# EAGLE design reg_board (EAGLE 9.6.2)
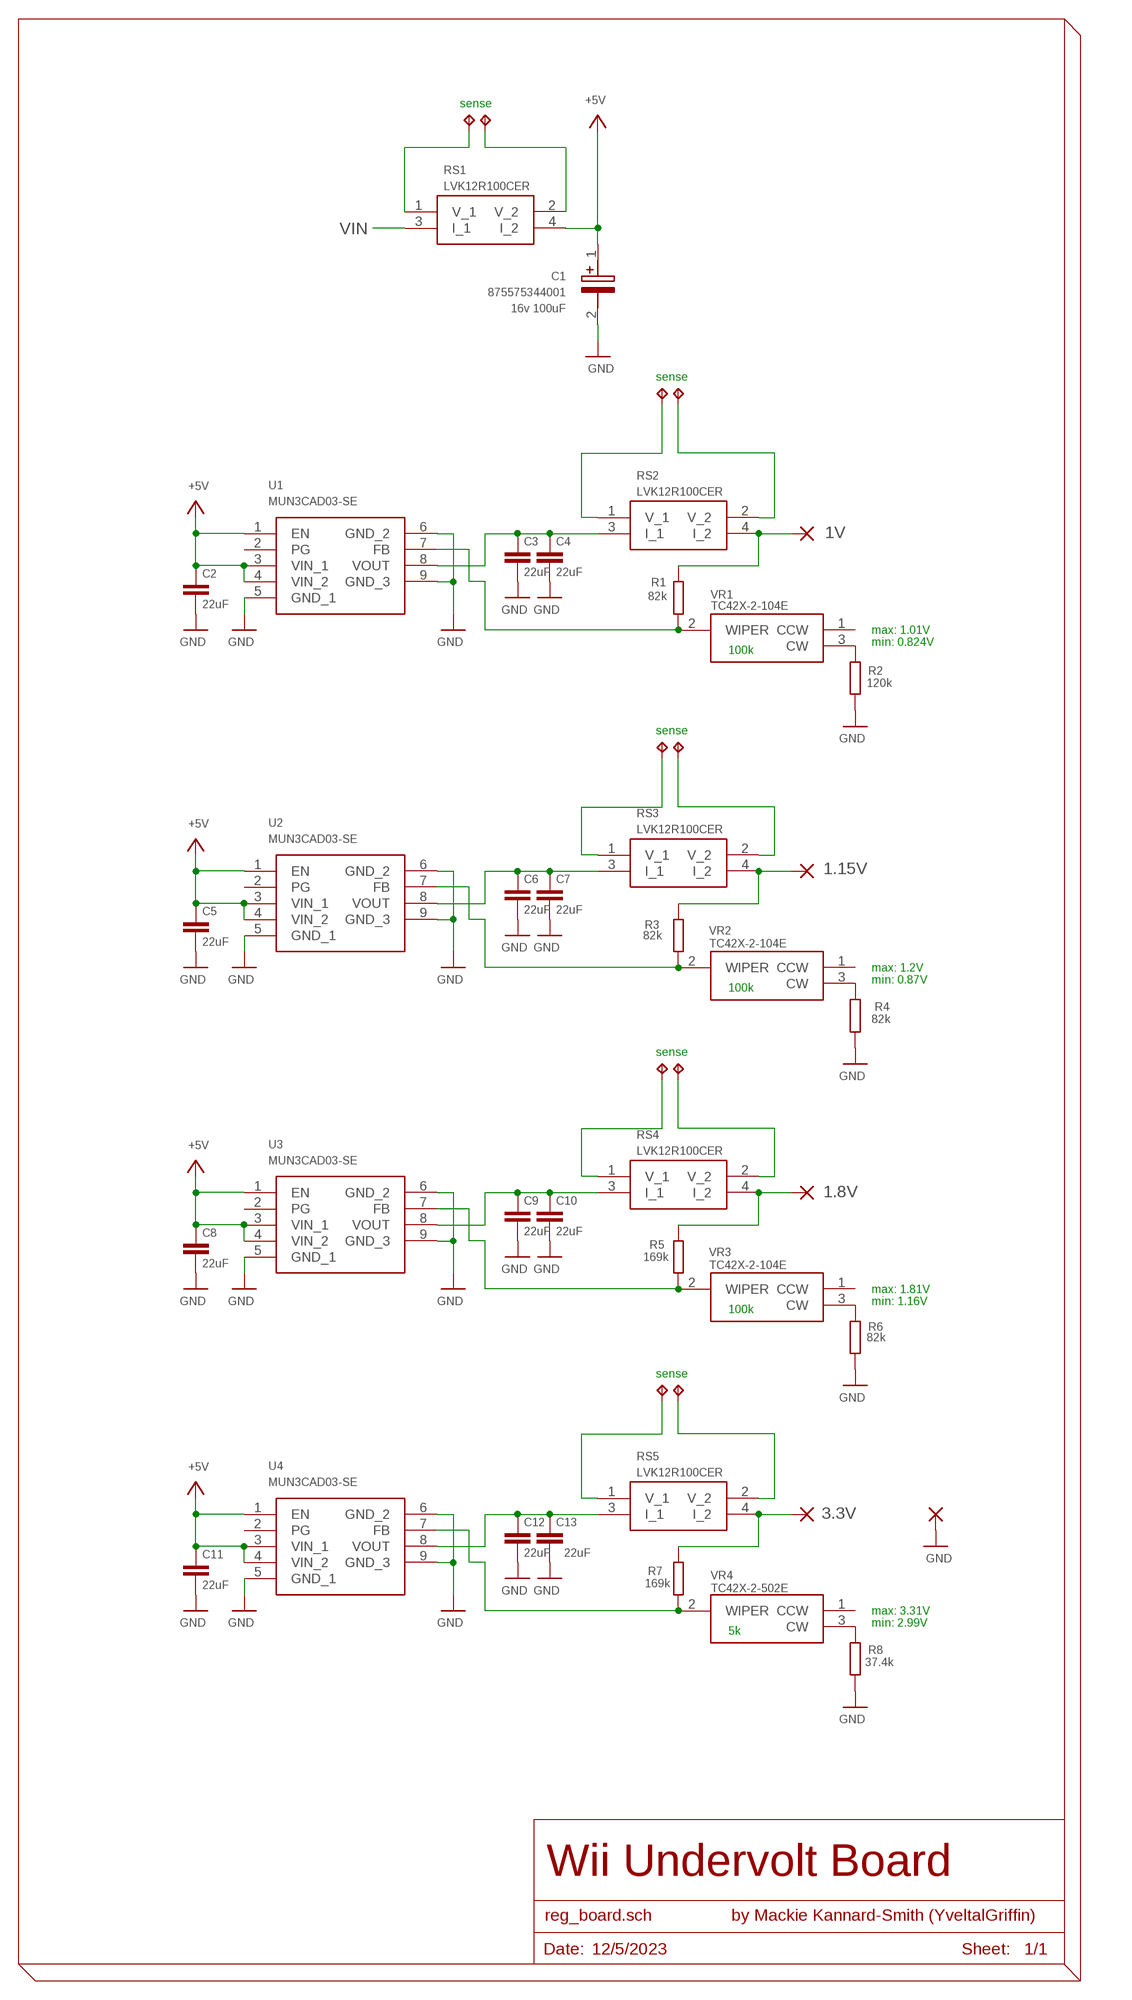
[diagram p0: schematic, sheet 1]

## Parts
C1  875575344001  [CAPAE660X610N]
C2  22uF  C-USC0603  [C0603]
C3  22uF  C-USC0603  [C0603]
C4  22uF  C-USC0603  [C0603]
C5  22uF  C-USC0603  [C0603]
C6  22uF  C-USC0603  [C0603]
C7  22uF  C-USC0603  [C0603]
C8  22uF  C-USC0603  [C0603]
C9  22uF  C-USC0603  [C0603]
C10  22uF  C-USC0603  [C0603]
C11  22uF  C-USC0603  [C0603]
C12  22uF  C-USC0603  [C0603]
C13  22uF  C-USC0603  [C0603]
PAD1  SMD5  [SMD2,54-5,08]
PAD2  SMD5  [SMD2,54-5,08]
PAD3  SMD5  [SMD2,54-5,08]
PAD4  SMD5  [SMD2,54-5,08]
PAD5  SMD5  [SMD2,54-5,08]
R1  82k  R-US_R0402  [R0402]
R2  120k  R-US_R0402  [R0402]
R3  82k  R-US_R0402  [R0402]
R4  82k  R-US_R0402  [R0402]
R5  169k  R-US_R0402  [R0402]
R6  82k  R-US_R0402  [R0402]
R7  169k  R-US_R0402  [R0402]
R8  37.4k  R-US_R0402  [R0402]
RS1  LVK12R100CER  [LVK12R100CER]
RS2  LVK12R100CER  [LVK12R100CER]
RS3  LVK12R100CER  [LVK12R100CER]
RS4  LVK12R100CER  [LVK12R100CER]
RS5  LVK12R100CER  [LVK12R100CER]
TP1  TPTP08R  [TP08R]
TP2  TPTP08R  [TP08R]
TP3  TPTP08R  [TP08R]
TP4  TPTP08R  [TP08R]
TP5  TPTP08R  [TP08R]
TP6  TPTP08R  [TP08R]
TP7  TPTP08R  [TP08R]
TP8  TPTP08R  [TP08R]
TP9  TPTP08R  [TP08R]
TP10  TPTP08R  [TP08R]
U1  MUN3CAD03-SE  [MUN3CAD03SE]
U2  MUN3CAD03-SE  [MUN3CAD03SE]
U3  MUN3CAD03-SE  [MUN3CAD03SE]
U4  MUN3CAD03-SE  [MUN3CAD03SE]
VR1  TC42X-2-104E  [TC42X2103E]
VR2  TC42X-2-104E  [TC42X2103E]
VR3  TC42X-2-104E  [TC42X2103E]
VR4  TC42X-2-502E  TC42X-2-104E  [TC42X2103E]

## Nets
1.8V: PAD4.1(P) R5.2 RS4.4(I_2)
1.15V: PAD3.1(P) R3.2 RS3.4(I_2)
1V: PAD1.1(P) R1.2 RS2.4(I_2)
3.3V: PAD5.1(P) R7.2 RS5.4(I_2)
+5V: C1.1(+) C2.1 C5.1 C8.1 C11.1 RS1.4(I_2) U1.1(EN) U1.3(VIN_1) U1.4(VIN_2) U2.1(EN) U2.3(VIN_1) U2.4(VIN_2) U3.1(EN) U3.3(VIN_1) U3.4(VIN_2) U4.1(EN) U4.3(VIN_1) U4.4(VIN_2)
GND: C1.2(-) C2.2 C3.2 C4.2 C5.2 C6.2 C7.2 C8.2 C9.2 C10.2 C11.2 C12.2 C13.2 PAD2.1(P) R2.1 R4.1 R6.1 R8.1 U1.5(GND_1) U1.6(GND_2) U1.9(GND_3) U2.5(GND_1) U2.6(GND_2) U2.9(GND_3) U3.5(GND_1) U3.6(GND_2) U3.9(GND_3) U4.5(GND_1) U4.6(GND_2) U4.9(GND_3)
N$1: R2.2 VR1.3(CW)
N$2: R4.2 VR2.3(CW)
N$3: R1.1 U1.7(FB) VR1.2(WIPER)
N$4: RS2.1(V_1) TP1.TP
N$5: RS2.2(V_2) TP2.TP
N$6: R6.2 VR3.3(CW)
N$7: RS1.2(V_2) TP3.TP
N$8: RS1.1(V_1) TP4.TP
N$9: R3.1 U2.7(FB) VR2.2(WIPER)
N$10: RS3.1(V_1) TP5.TP
N$11: RS3.2(V_2) TP6.TP
N$12: R5.1 U3.7(FB) VR3.2(WIPER)
N$13: RS4.1(V_1) TP7.TP
N$14: RS4.2(V_2) TP8.TP
N$15: R7.1 U4.7(FB) VR4.2(WIPER)
N$16: RS5.1(V_1) TP9.TP
N$17: RS5.2(V_2) TP10.TP
N$18: R8.2 VR4.3(CW)
VIN: RS1.3(I_1)
VOUT1: C3.1 C4.1 RS2.3(I_1) U1.8(VOUT)
VOUT2: C6.1 C7.1 RS3.3(I_1) U2.8(VOUT)
VOUT3: C9.1 C10.1 RS4.3(I_1) U3.8(VOUT)
VOUT4: C12.1 C13.1 RS5.3(I_1) U4.8(VOUT)
Unconnected: U1.2(PG) U2.2(PG) U3.2(PG) U4.2(PG) VR1.1(CCW) VR2.1(CCW) VR3.1(CCW) VR4.1(CCW)

## Notes on the sheet
- sense
- 16v 100uF
- sense
- max: 1.01V
  min: 0.824V
- 100k
- sense
- max: 1.2V
  min: 0.87V
- 100k
- sense
- max: 1.81V
  min: 1.16V
- 100k
- sense
- max: 3.31V
  min: 2.99V
- 5k
- Wii Undervolt Board
- reg_board.sch | by Mackie Kannard-Smith (YveltalGriffin)
- Date: | 12/5/2023 | Sheet:   1/1

## Library data of the parts
C1 = SamacSys_Parts:875575344001: Operating Temperature -55 up to +105 C Source: Datasheet <https://www.mouser.lu/datasheet/2/445/1/875575344001-3133041.pdf>; DESCRIPTION: Operating Temperature -55 up to +105 C; HEIGHT: 6.1mm; MANUFACTURER_NAME: Wurth Elektronik; MANUFACTURER_PART_NUMBER: 875575344001
C2-C13 = resistor:C-US: CAPACITOR, American symbol
PAD1-PAD5 = wirepad:SMD5: SMD PAD
R1-R8 = resistor:R-US_: RESISTOR, American symbol
RS1-RS5 = SamacSys_Parts:LVK12R100CER: Current Sense Resistors - SMD .1 OHM.25% 1/2W Source: Datasheet <https://www.ohmite.com/assets/docs/res_lvk.pdf>; DESCRIPTION: Current Sense Resistors - SMD .1 OHM.25% 1/2W; HEIGHT: 0.65mm; MANUFACTURER_NAME: Ohmite; MANUFACTURER_PART_NUMBER: LVK12R100CER; MOUSER_PART_NUMBER: 588-LVK12R100CER; MOUSER_PRICE-STOCK: https://www.mouser.co.uk/ProductDetail/Ohmite/LVK12R100CER?qs=Cb2nCFKsA8oBVfMdwpyWoQ%3D%3D
TP1-TP10 = testpad:TP: Test pad
U1-U4 = SamacSys_Parts:MUN3CAD03-SE: Non-Isolated DC/DC Converters 3A 5Vin inductor-integrated DC-DC converters Source: Datasheet; DESCRIPTION: Non-Isolated DC/DC Converters 3A 5Vin inductor-integrated DC-DC converters; HEIGHT: 1.3mm; MANUFACTURER_NAME: Delta Electronics; MANUFACTURER_PART_NUMBER: MUN3CAD03-SE; MOUSER_PART_NUMBER: 108-MUN3CAD03-SE; MOUSER_PRICE-STOCK: https://www.mouser.co.uk/ProductDetail/Delta-Electronics/MUN3CAD03-SE?qs=t7xnP681wgWoX6LfHO%2FvWw%3D%3D
VR1-VR4 = SamacSys_Parts:TC42X-2-104E: Trimmer Resistors - SMD 100K 2mm SMD Single Turn Source: Datasheet <https://www.bourns.com/docs/Product-Datasheets/TC42.pdf>; DESCRIPTION: Trimmer Resistors - SMD 100K 2mm SMD Single Turn; HEIGHT: 0.9mm; MANUFACTURER_NAME: Bourns; MANUFACTURER_PART_NUMBER: TC42X-2-104E; MOUSER_PART_NUMBER: 652-TC42X-2-104E; MOUSER_PRICE-STOCK: https://www.mouser.co.uk/ProductDetail/Bourns/TC42X-2-104E?qs=QYa8ZXxbnEbE7GBci46ntg%3D%3D

## Board
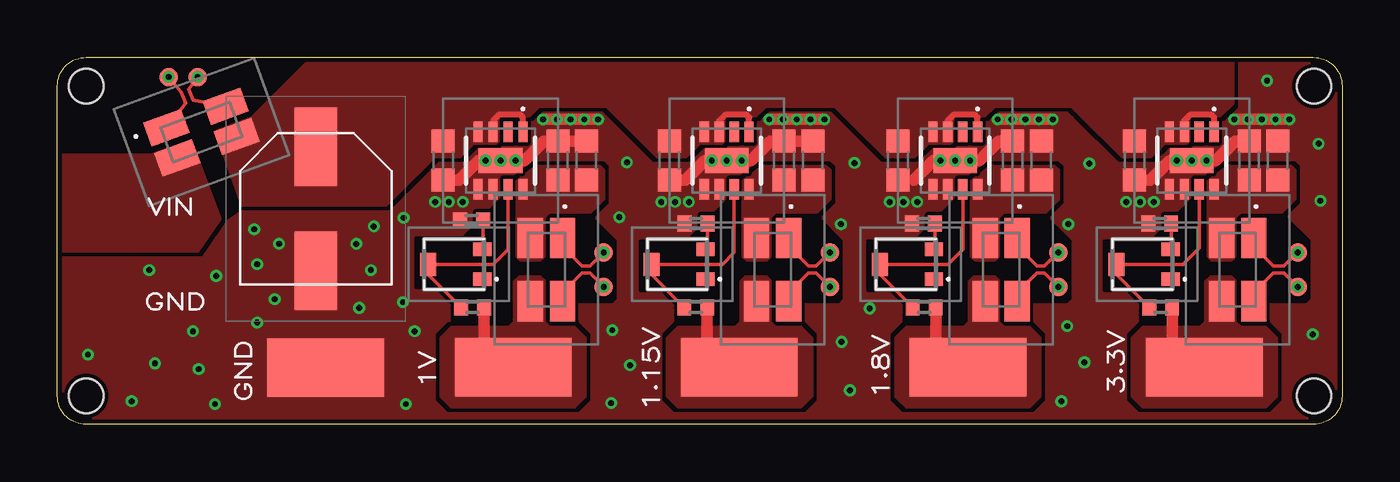
[diagram p1: board, top side]
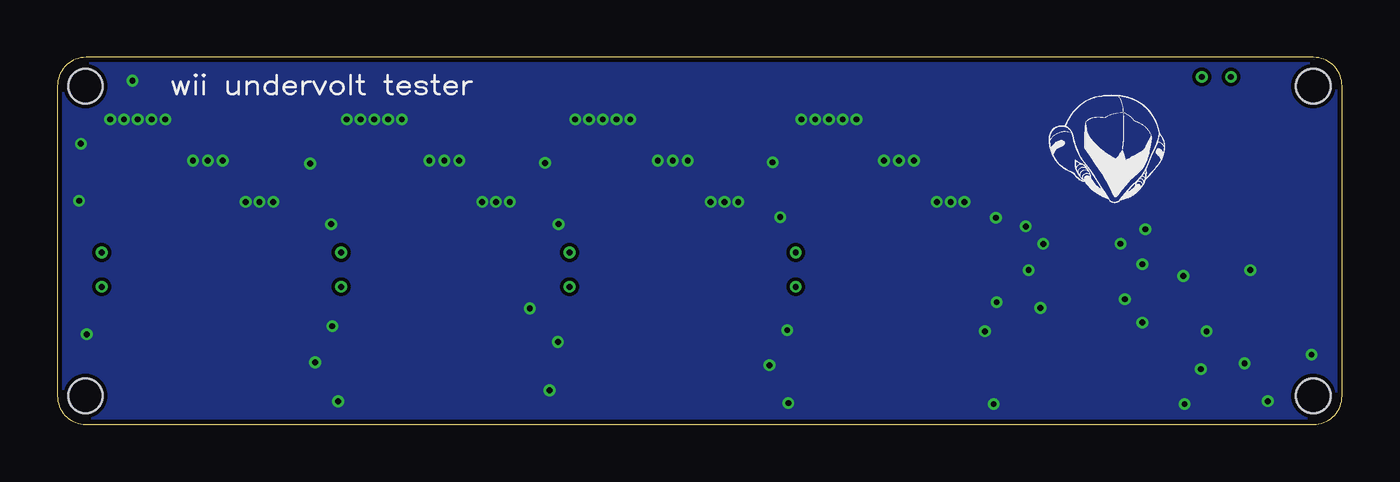
[diagram p2: board, bottom side, seen from below]

Size 55.95 x 16 mm. Coordinates in mm from the lower left corner, seen from the top.
Outline: 55.95,14.75 55.95,1.25 arc-90 54.7,0 1.25,0 arc-90 0,1.25 0,14.75 arc-90 1.25,16 54.7,16 arc-90 55.95,14.75
Copper layers (1*16): Top 0.035mm / dielectric 1.5mm / Bottom 0.035mm
Design rules "default *": minimum track width 6mil, minimum drill 10mil, track to track 5mil, track to pad 5mil, pad to pad 5mil, via to via 5mil, smd to smd 5mil, copper to edge 8mil, drill to drill 6mil, minimum pad ring 4mil, minimum via ring 4mil, stop-mask expansion 1.5mil, vias tented up to drill 50mil, thermal gap 10mil
Holes 1.5 mm at 1.25,1.25 1.25,14.75 54.72,14.75 54.72,1.25
tRestrict: 5 lines

### Footprints (pad centres in the part's own frame; a part is rotated, then mirrored left to right if it is on the bottom)
CAPAE660X610N = smd 3.4 x 1.85: 1 -2.7,0; 2 2.7,0
C0603 = smd 1 x 1: 1 -0.85,0; 2 0.85,0
SMD2,54-5,08 = smd 2.54 x 5.08: 1 0,0
R0402 = smd 0.6 x 0.7: 1 -0.5,0; 2 0.5,0
LVK12R100CER = smd 1.75 x 1.1: 1 -1.375,0.7; 2 1.375,0.7; 3 -1.375,-0.7; 4 1.375,-0.7
TP08R = smd 0.8 x 0.8: TP 0,0
MUN3CAD03SE = smd 0.9 x 0.4: 1 -1.25,0.975; 2 -1.25,0.325; 3 -1.25,-0.325; 4 -1.25,-0.975; 5 1.25,-0.975; 6 1.25,-0.325; 7 1.25,0.325; 8 1.25,0.975 | smd 1.1 x 1.9: 9 0,0
TC42X2103E = smd 0.6 x 0.8: 1 -0.65,-1.175; 3 0.65,-1.175 | smd 1 x 0.7: 2 0,1.175

### Placement (x,y rotation side)
C1  11.25,9.4 270 top
C2  16.8,11.5 270 top
C3  23.05,11.5 90 top
C4  21.8,11.5 90 top
C5  26.65,11.5 270 top
C6  32.9,11.5 90 top
C7  31.65,11.5 90 top
C8  36.6,11.5 270 top
C9  42.85,11.5 90 top
C10  41.6,11.5 90 top
C11  46.9,11.5 270 top
C12  53.15,11.5 90 top
C13  51.9,11.5 90 top
PAD1  19.85,2.5 90 top
PAD2  11.68,2.48 270 top
PAD3  29.7,2.5 90 top
PAD4  39.65,2.5 90 top
PAD5  49.95,2.5 90 top
R1  18.08,5.11 0 top
R2  18.03,8.89 0 top
R3  27.8,5.11 0 top
R4  27.81,8.76 0 top
R5  37.75,5.11 0 top
R6  37.72,8.76 0 top
R7  48.05,5.11 0 top
R8  48.01,8.76 0 top
RS1  6.28,12.74 20 top
RS2  21.3,6.75 270 top
RS3  31.15,6.75 270 top
RS4  41.1,6.75 270 top
RS5  51.4,6.75 270 top
TP1  23.79,7.5 0 top
TP2  23.79,6 0 top
TP3  6.11,15.15 270 top
TP4  4.84,15.15 270 top
TP5  33.64,7.5 0 top
TP6  33.64,6 0 top
TP7  43.59,7.5 0 top
TP8  43.59,6 0 top
TP9  54.02,7.5 0 top
TP10  54.02,6 0 top
U1  19.3,11.5 270 top
U2  29.15,11.5 270 top
U3  39.1,11.5 270 top
U4  49.4,11.5 270 top
VR1  17.33,6.98 90 top
VR2  27.05,6.98 90 top
VR3  37,6.98 90 top
VR4  47.3,6.98 90 top

### Tracks (layer width: path | path; a pad name or v marks a point on that pad's centre or on a via)
1.8V
  Top 0.508: 40.3,5.11 40.53,5.34 | R5.2 38.25,2.82 38.23,2.79
  pour Top (no thermals): 39.65,6.25 39.9,6.5 40.85,6.5 41.05,6.3 41.05,4.5 41.25,4.3 42.35,4.3 42.85,3.8 42.85,1.2 42.35,0.7 36.95,0.7 36.45,1.2 36.45,3.8 36.95,4.3 39.45,4.3 39.65,4.5
1.15V
  Top 0.508: 30.23,5.11 30.58,5.46 | R3.2 28.3,2.94 28.32,2.92
  pour Top (no thermals): 29.7,6.25 29.95,6.5 30.9,6.5 31.1,6.3 31.1,4.5 31.3,4.3 32.4,4.3 32.9,3.8 32.9,1.2 32.4,0.7 27,0.7 26.5,1.2 26.5,3.8 27,4.3 29.5,4.3 29.7,4.5
1V
  Top 0.508: 20.38,5.11 20.73,5.46 | R1.2 18.58,3.14 18.67,3.05
  pour Top (no thermals): 19.85,6.25 20.1,6.5 21.05,6.5 21.25,6.3 21.25,4.5 21.45,4.3 22.55,4.3 23.05,3.8 23.05,1.2 22.55,0.7 17.15,0.7 16.65,1.2 16.65,3.8 17.15,4.3 19.65,4.3 19.85,4.5
3.3V
  Top 0.508: 50.6,5.11 50.83,5.34 | R7.2 48.55,3.21 48.51,3.17
  pour Top (no thermals): 49.95,6.25 50.2,6.5 51.15,6.5 51.35,6.3 51.35,4.5 51.55,4.3 52.65,4.3 53.15,3.8 53.15,1.2 52.65,0.7 47.25,0.7 46.75,1.2 46.75,3.8 47.25,4.3 49.75,4.3 49.95,4.5
+5V
  Top 0.254: U1.1 20.27,13.38 20.15,13.5 19.24,13.5 18.98,13.24 U1.3 | U2.1 30.12,13.38 30,13.5 29.09,13.5 28.82,13.24 U2.3 | U3.1 40.08,13.38 39.95,13.5 39.04,13.5 38.77,13.24 U3.3 | U4.1 50.38,13.38 50.25,13.5 49.34,13.5 49.08,13.24 U4.3
  pour Top (no thermals): 16.25,11.6 17.55,11.6 18.15,12.2 19.12,12.2 19.25,12.33 19.25,13.38 19.13,13.5 16.25,13.5 15.95,13.2 15.95,11.9
  pour Top (no thermals): 26.1,11.6 27.4,11.6 28,12.2 28.97,12.2 29.1,12.33 29.1,13.38 28.98,13.5 24.2,13.5
  pour Top (no thermals): 36.05,11.6 37.35,11.6 37.95,12.2 38.92,12.2 39.05,12.33 39.05,13.38 38.93,13.5 34.15,13.5
  pour Top (no thermals): 46.35,11.6 47.65,11.6 48.25,12.2 49.22,12.2 49.35,12.33 49.35,13.38 49.23,13.5 44.45,13.5
  pour Top (isolate 0.152, no thermals): 8.44,13.42 6.83,12.8 8.01,9.5 14.34,9.5 18.23,13.39 20.58,13.39 21.01,13.82 23.88,13.82 24.32,13.39 30.44,13.39 30.87,13.82 33.83,13.82 34.26,13.39 40.41,13.39 40.84,13.82 44.13,13.82 44.56,13.39 50.67,13.39 51.25,13.97 51.25,16.25 11.27,16.25
CUTOUT
  cutout Top (rank 2, no thermals): 22.38,9.02 23.27,9.02 24.28,8 24.28,5.49 24.16,5.36 22.38,5.36
  cutout Top (rank 2, no thermals): 32.23,9.02 33.12,9.02 34.13,8 34.13,5.49 34.01,5.36 32.23,5.36
  cutout Top (rank 2, no thermals): 42.18,9.02 43.07,9.02 44.09,8 44.09,5.49 43.96,5.36 42.18,5.36
  cutout Top (rank 2, no thermals): 52.47,9.03 53.49,9.03 54.5,8.01 54.5,5.5 54.38,5.37 52.47,5.37
  cutout Top (rank 2, no thermals): 15.62,5.97 15.62,8.13 17.67,8.13 19.43,9.91 19.66,9.68 19.66,5.97
  cutout Top (rank 2, no thermals): 25.4,5.84 25.4,8 27.45,8 29.2,9.78 29.44,9.55 29.44,5.84
  cutout Top (rank 2, no thermals): 35.31,5.84 35.31,8 37.36,8 39.11,9.78 39.34,9.55 39.34,5.84
  cutout Top (rank 2, no thermals): 45.59,5.84 45.59,8 47.64,8 49.4,9.78 49.63,9.55 49.63,5.84
GND  (via drill 0.25 pad 0.51)
  Top 0.508: C3.2 C4.2 21.2,12.35 20.35,11.5 U1.9 18.35,11.5 17.5,10.65 C2.2 | C6.2 C7.2 31.05,12.35 30.2,11.5 U2.9 28.2,11.5 27.35,10.65 C5.2 | U3.9 38.15,11.5 37.3,10.65 | C10.2 41,12.35 40.15,11.5 | C11.2 47.6,10.65 48.45,11.5 | C13.2 51.3,12.35 50.45,11.5 | v21.15,13.3 v23.55,13.3 | v31,13.3 v33.4,13.3 | v40.95,13.3 v43.35,13.3 | v51.25,13.3 v53.65,13.3
  other vias: 19.3,11.5 18.65,11.5 19.95,11.5 21.75,13.3 22.35,13.3 22.95,13.3 16.45,9.7 17.05,9.7 17.65,9.7 29.15,11.5 28.5,11.5 29.8,11.5 31.6,13.3 32.2,13.3 32.8,13.3 26.3,9.7 26.9,9.7 27.5,9.7 39.1,11.5 38.45,11.5 39.75,11.5 41.55,13.3 42.15,13.3 42.75,13.3 36.25,9.7 36.85,9.7 37.45,9.7 49.4,11.5 48.75,11.5 50.05,11.5 51.85,13.3 52.45,13.3 53.05,13.3 46.55,9.7 47.15,9.7 47.75,9.7 6.86,0.89 15.08,9.01 24.12,0.93 24.94,2.58 24.17,4.11 24.47,9.04 24.8,11.42 34.71,11.4 44.95,11.37 34.13,8.73 35.37,5.06 34.15,3.6 34.51,1.49 43.73,1.01 44.73,2.71 43.98,4.29 44.03,8.73 54.93,12.24 55,9.75 54.67,3.93 52.68,14.99 6.92,6.47 3.23,1.01 1.33,3.05 4.25,2.66 4,6.73 5.9,4.06 6.16,2.41 8.7,4.44 9.65,7.87 8.57,8.51 13.01,7.87 13.14,5.08 15.05,5.33 15.55,4.06 15.17,0.89 9.46,5.46 13.65,6.73 13.78,8.63 8.7,6.98
  pour Top (no thermals): 9,4.3 14.4,4.3 14.9,3.8 14.9,1.2 14.4,0.7 9,0.7 8.5,1.2 8.5,3.8
  pour Top (isolate 0.152, rank 2, no thermals): 55.95,0 0,0 0,16 55.95,16
  pour Bottom (isolate 0.152, rank 2, no thermals): 55.95,0 0,0 0,16 55.95,16
N$1
  Top 0.152: R2.2 18.53,7.67 VR1.3
N$2
  Top 0.152: R4.2 28.31,7.72 VR2.3
N$3
  Top 0.152: U1.7 19.62,7.63 18.98,6.98 VR1.2 16.15,6.54 R1.1
N$4  (via drill 0.25 pad 0.51)
  Top 0.152: RS2.1 22,7.75 22.85,6.9 23.19,6.9 TP1.TP
  other vias: 23.79,7.5
N$5  (via drill 0.25 pad 0.51)
  Top 0.152: RS2.2 22,5.75 22.85,6.6 23.19,6.6 TP2.TP
  other vias: 23.79,6
N$6
  Top 0.152: R6.2 38.22,7.68 VR3.3
N$7  (via drill 0.25 pad 0.51)
  Top 0.152: RS1.2 5.9,14.14 5.71,14.61 TP3.TP
  other vias: 6.11,15.15
N$8  (via drill 0.25 pad 0.51)
  Top 0.152: RS1.1 4.76,12.95 5.58,14 5.38,14.49 TP4.TP
  other vias: 4.84,15.15
N$9
  Top 0.152: U2.7 29.48,8.89 29.48,8.78 29.48,7.5 28.95,6.98 27.68,6.98 27.56,6.98 VR2.2 25.88,6.54 R3.1
N$10  (via drill 0.25 pad 0.51)
  Top 0.152: RS3.1 31.85,7.75 32.7,6.9 33.04,6.9 TP5.TP
  other vias: 33.64,7.5
N$11  (via drill 0.25 pad 0.51)
  Top 0.152: RS3.2 31.85,5.75 32.7,6.6 33.04,6.6 TP6.TP
  other vias: 33.64,6
N$12
  Top 0.152: U3.7 39.42,7.63 38.78,6.98 VR3.2 35.83,6.54 R5.1
N$13  (via drill 0.25 pad 0.51)
  Top 0.152: RS4.1 41.8,7.75 42.65,6.9 42.99,6.9 TP7.TP
  other vias: 43.59,7.5
N$14  (via drill 0.25 pad 0.51)
  Top 0.152: RS4.2 41.8,5.75 42.65,6.6 42.99,6.6 TP8.TP
  other vias: 43.59,6
N$15
  Top 0.152: R7.1 46.12,6.54 VR4.2 49.02,6.98 49.73,7.69 U4.7
N$16  (via drill 0.25 pad 0.51)
  Top 0.152: RS5.1 52.1,7.75 52.95,6.9 53.42,6.9 TP9.TP
  other vias: 54.02,7.5
N$17  (via drill 0.25 pad 0.51)
  Top 0.152: RS5.2 52.1,5.75 52.95,6.6 53.42,6.6 TP10.TP
  other vias: 54.02,6
N$18
  Top 0.152: R8.2 48.51,7.67 VR4.3
VIN
  pour Top (no thermals): 5.84,12.45 4.06,11.81 -0.51,11.81 -0.51,7.49 6.14,7.49 7.15,8.95
VOUT1
  pour Top (no thermals): 19.95,10.62 20.83,11.3 23.65,11.3 23.85,11.1 23.85,9.8 23.25,9.2 21.45,9.2 21.25,9 21.25,7.3 21.05,7.1 20.15,7.1 19.95,7.3
VOUT2
  pour Top (no thermals): 29.8,10.62 30.68,11.3 33.5,11.3 33.7,11.1 33.7,9.8 33.1,9.2 31.3,9.2 31.1,9 31.1,7.3 30.9,7.1 30,7.1 29.8,7.3
VOUT3
  pour Top (no thermals): 39.75,10.62 40.63,11.3 43.45,11.3 43.65,11.1 43.65,9.8 43.05,9.2 41.25,9.2 41.05,9 41.05,7.3 40.85,7.1 39.95,7.1 39.75,7.3
VOUT4
  pour Top (no thermals): 50.05,10.62 50.93,11.3 53.75,11.3 53.95,11.1 53.95,9.8 53.35,9.2 51.55,9.2 51.35,9 51.35,7.3 51.15,7.1 50.25,7.1 50.05,7.3